# Altium schematic sheet CareLite 1.21.schdoc
size 296 x 208 mm
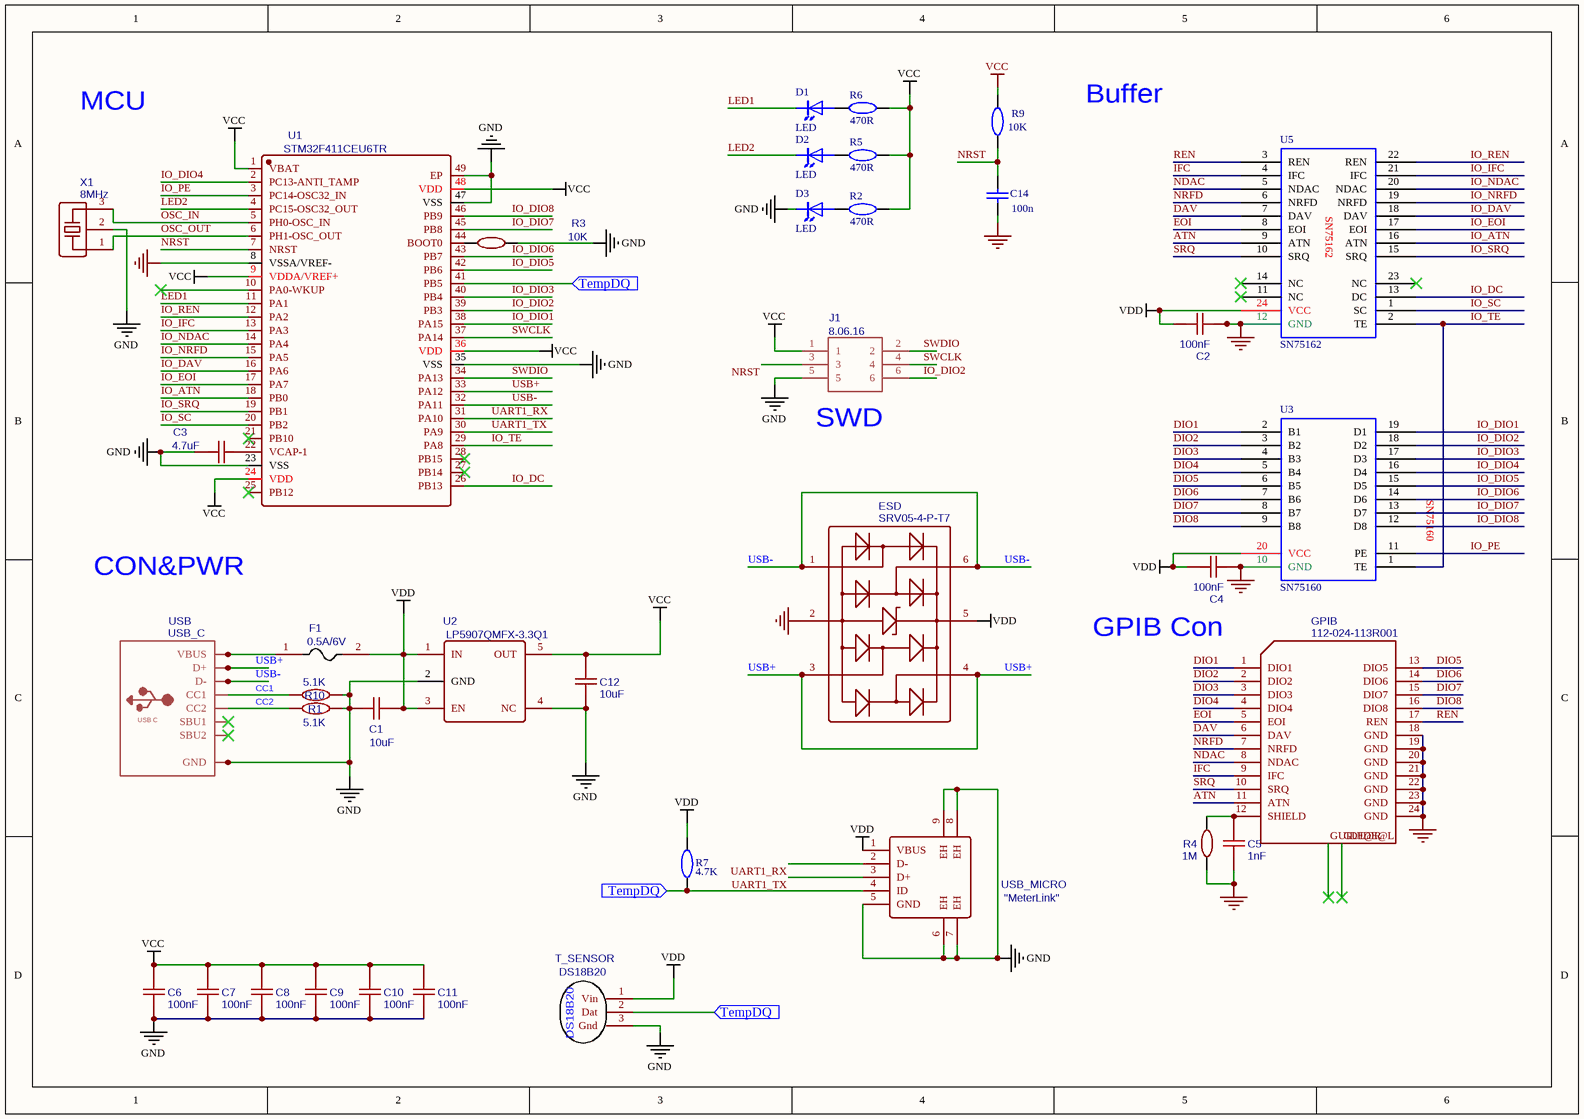
[diagram p0: CareLite 1.21.schdoc]

## Parts
C1  10uF  [C0603]
C2  100nF  [C0603]
C3  4.7uF  [C0603]
C4  100nF  [C0603]
C5  1nF  [C0603]
C6  100nF  [C0603]
C7  100nF  [C0603]
C8  100nF  [C0603]
C9  100nF  [C0603]
C10  100nF  [C0603]
C11  100nF  [C0603]
C12  10uF  [C0603]
C14  100n  [C0603]
D1  LED  [LED0603-FD]
D2  LED  [LED0603-FD]
D3  LED  [LED0603-FD]
ESD  SRV05-4-P-T7  [SOT-23-6_L2.9-W1.6-P0.95-LS2.8-BL]
F1  0.5A/6V  [0805_L_JX]
GPIB  112-024-113R001  [IEEE-488 SOCKET, 24PIN, RIGHT ANGLE, MALE, 112-024-113R001, FUY57109]
J1  8.06.16  [80616-S]
R1  5.1K  [R0603]
R2  470R  [R0603]
R3  10K  [R0603]
R4  1M  [R0603]
R5  470R  [R0603]
R6  470R  [R0603]
R7  4.7K  [R0603]
R9  10K  [R0603]
R10  5.1K  [R0603]
T_SENSOR  DS18B20  [DS18B20]
U1  STM32F411CEU6TR  [QFN-48_L7.0-W7.0-P0.50-BL-EP5.1]
U2  LP5907QMFX-3.3Q1  [SOT-23-5_L3.0-W1.7-P0.95-LS2.8-BR]
U3  SN75160  [SOIC127P1030-20AM]
U5  SN75162  [SOIC127P1030-24AM]
USB  USB_C  [USB_C_CUSB31-CFM2AX-01-Y]
USB_MICRO  "MeterLink"  [MIRCO-USB-SMD_U-D-M7DS-G-2]
X1  8MHz  [OSC-SMD_3P-L3.2-W1.3-P1.2-L]

## Ports
TempDQ (in)

## Nets
GND: C1.1 C2.2 C3.1 C4.2 C5.1 C6.1 C7.1 C8.1 C9.1 C10.1 C11.1 C12.1 C14.1 D3.2 ESD.2 GPIB.18(GND) GPIB.19(GND) GPIB.20(GND) GPIB.21(GND) GPIB.22(GND) GPIB.23(GND) GPIB.24(GND) J1.5 R1.2 R3.2 R4.2 R10.2 T_SENSOR.3(Gnd) U1.8(VSSA/VREF-) U1.23(VSS) U1.35(VSS) U1.47(VSS) U1.49(EP) U2.2(GND) U2.4(NC) U3.10(GND) U5.12(GND) USB.A1B12(GND) USB.B1A12(GND) USB_MICRO.5(GND) USB_MICRO.6(EH) USB_MICRO.7(EH) USB_MICRO.8(EH) USB_MICRO.9(EH) X1.2
VCC: C6.2 C7.2 C8.2 C9.2 C10.2 C11.2 C12.2 J1.1 R2.1 R5.1 R6.1 R9.2 U1.1(VBAT) U1.9(VDDA/VREF+) U1.24(VDD) U1.36(VDD) U1.48(VDD) U2.5(OUT)
VDD: C1.2 C2.1 C4.1 ESD.5 F1.2 R7.1 T_SENSOR.1(Vin) U2.1(IN) U2.3(EN) U3.20(VCC) U5.24(VCC) USB_MICRO.1(VBUS)
ATN: GPIB.11(ATN) U5.9(ATN)
CC1: R10.1 USB.A5(CC1)
CC2: R1.1 USB.B5(CC2)
DAV: GPIB.6(DAV) U5.7(DAV)
DIO1: GPIB.1(DIO1) U3.2(B1)
DIO2: GPIB.2(DIO2) U3.3(B2)
DIO3: GPIB.3(DIO3) U3.4(B3)
DIO4: GPIB.4(DIO4) U3.5(B4)
DIO5: GPIB.13(DIO5) U3.6(B5)
DIO6: GPIB.14(DIO6) U3.7(B6)
DIO7: GPIB.15(DIO7) U3.8(B7)
DIO8: GPIB.16(DIO8) U3.9(B8)
EOI: GPIB.5(EOI) U5.8(EOI)
IFC: GPIB.9(IFC) U5.4(IFC)
IO_ATN: U1.18(PB0) U5.16(ATN)
IO_DAV: U1.16(PA6) U5.18(DAV)
IO_DC: U1.26(PB13) U5.13(DC)
IO_DIO1: U1.38(PA15) U3.19(D1)
IO_DIO2: J1.6 U1.39(PB3) U3.18(D2)
IO_DIO3: U1.40(PB4) U3.17(D3)
IO_DIO4: U1.2(PC13-ANTI_TAMP) U3.16(D4)
IO_DIO5: U1.42(PB6) U3.15(D5)
IO_DIO6: U1.43(PB7) U3.14(D6)
IO_DIO7: U1.45(PB8) U3.13(D7)
IO_DIO8: U1.46(PB9) U3.12(D8)
IO_EOI: U1.17(PA7) U5.17(EOI)
IO_IFC: U1.13(PA3) U5.21(IFC)
IO_NDAC: U1.14(PA4) U5.20(NDAC)
IO_NRFD: U1.15(PA5) U5.19(NRFD)
IO_PE: U1.3(PC14-OSC32_IN) U3.11(PE)
IO_REN: U1.12(PA2) U5.22(REN)
IO_SC: U1.20(PB2) U5.1(SC)
IO_SRQ: U1.19(PB1) U5.15(SRQ)
IO_TE: U1.29(PA8) U3.1(TE) U5.2(TE)
LED1: D1.2 U1.11(PA1)
LED2: D2.2 U1.4(PC15-OSC32_OUT)
NDAC: GPIB.8(NDAC) U5.5(NDAC)
NRFD: GPIB.7(NRFD) U5.6(NRFD)
NRST: C14.2 J1.3 R9.1 U1.7(NRST)
OSC_IN: U1.5(PH0-OSC_IN) X1.3
OSC_OUT: U1.6(PH1-OSC_OUT) X1.1
REN: GPIB.17(REN) U5.3(REN)
SRQ: GPIB.10(SRQ) U5.10(SRQ)
SWCLK: J1.4 U1.37(PA14)
SWDIO: J1.2 U1.34(PA13)
TempDQ: R7.2 T_SENSOR.2(Dat) U1.41(PB5) USB_MICRO.4(ID) ; port TempDQ
UART1_RX: U1.31(PA10) USB_MICRO.2(D-)
UART1_TX: U1.30(PA9) USB_MICRO.3(D+)
USB+: ESD.3 ESD.4 U1.33(PA12) USB.A6(D+) USB.B6(D+)
USB-: ESD.1 ESD.6 U1.32(PA11) USB.A7(D-) USB.B7(D-)
NetC3_2: C3.2 U1.22(VCAP-1)
NetC5_2: C5.2 GPIB.12(SHIELD) R4.1
NetD1_1: D1.1 R6.2
NetD2_1: D2.1 R5.2
NetD3_1: D3.1 R2.2
NetF1_1: F1.1 USB.A4B9(VBUS) USB.B4A9(VBUS)
NetR3_1: R3.1 U1.44(BOOT0)

Not connected (* = marked no-connect by the designer): GPIB GUIDE@L(P$25)* GUIDE@R(P$26)*; U1 10(PA0-WKUP)* 21(PB10)* 25(PB12)* 27(PB14)* 28(PB15)*; U5 11(NC)* 14(NC)* 23(NC)*; USB A8(SBU1)* B8(SBU2)*

## Notes on the sheet
- MCU
- Buffer
- (near J1) SWD
- CON&PWR
- GPIB Con
- (in symbol USB_C) USB C

## Library data of the parts
C1 C12 = 10uF: Manufacturer: TAIYO YUDEN; Manufacturer Part: LMK107BJ106MALTD; nameAlias: Capacitance; Supplier: LCSC; Supplier Part: C18800; spicePre: C; spiceSymbolName: LMK107BJ106MALTD
C2 C4 C6-C11 = 100nF: Manufacturer: YAGEO; Manufacturer Part: CC0402KRX7R7BB104; nameAlias: Capacitance; Supplier: LCSC; Supplier Part: C60474; spicePre: C; spiceSymbolName: CC0402KRX7R7BB104
C3 = 4.7uF: Manufacturer: Huaxin S&T; Manufacturer Part: 0603X475K160CT; nameAlias: Capacitance; Contributor: LCSC; Supplier: LCSC; Supplier Part: C296042; spicePre: C; spiceSymbolName: 0603X475K160CT
C5 = 1nF: Manufacturer: YAGEO; Manufacturer Part: CC0603KRX7RABB102; nameAlias: Capacitance; Contributor: LCSC; Supplier: LCSC; Supplier Part: C282243; spicePre: C; spiceSymbolName: CC0603KRX7RABB102
ESD = SRV05-4-P-T7: Manufacturer: PROTEK; SMT Type: Basic; Supplier: LCSC; Manufacturer Part: SRV05-4-P-T7; LCSC Assembly: Yes; image: //image.lceda.cn/szlcsc/C85364.jpg; Supplier Part: C85364; spicePre: T; spiceSymbolName: SRV05-4-P-T7
GPIB = 112-024-113R001: Manufacturer: norcomp; Contributor: misslee; Manufacturer Part: 112-024-113R001; Supplier: Mouser; Supplier Part: 636-112-024-113R001; link: https://www.norcomp.net/series/112-series; spicePre: C; spiceSymbolName: 112-024-113R001
J1 = 8.06.16: Contributor: misslee; spicePre: J; spiceSymbolName: 8.06.16
R1 R10 = 5.1K: Manufacturer: Guangdong Fenghua Advanced Tech; Manufacturer Part: RS-03K5101FT; nameAlias: Resistance (Ohms); Contributor: LCSC; Supplier: LCSC; Supplier Part: C156350; spicePre: R; spiceSymbolName: RS-03K5101FT
R3 = 10K: Manufacturer: YAGEO; Manufacturer Part: RC0402FR-0710KL; nameAlias: Resistance (Ohms); Supplier: LCSC; Supplier Part: C60490; spicePre: R; spiceSymbolName: RC0402FR-0710KL
R4 = 1M: Manufacturer: YAGEO; Manufacturer Part: RC0603JR-071ML; nameAlias: Resistance (Ohms); Supplier: LCSC; Supplier Part: C107698; spicePre: R; spiceSymbolName: RC0603JR-071ML
T_SENSOR = DS18B20: Contributor: aleja_claros; spicePre: U; spiceSymbolName: DS18B20
U1 = STM32F411CEU6TR: Manufacturer: STMicroelectronics; Manufacturer Part: STM32F411CCU6TR; Contributor: LCSC; SMT Type: Extend; Supplier: LCSC; Supplier Part: C190642; LCSC Assembly: Yes; spicePre: U; spiceSymbolName: STM32F411CCU6TR
U2 = LP5907QMFX-3.3Q1: Manufacturer: TI; Contributor: LCSC; SMT Type: Extend; Supplier: LCSC; Manufacturer Part: LP5907QMFX-3.3Q1; Supplier Part: C130005; JLCPCB SMD: Yes; spicePre: U; spiceSymbolName: LP5907QMFX-3.3Q1
USB = USB_C: Contributor: misslee; spicePre: X; spiceSymbolName: USB_C
USB_MICRO = "MeterLink": Manufacturer: XKB Connectivity(中国星坤); Manufacturer Part: U-D-M7DS-G-2; Contributor: LCSC; Supplier: LCSC; Supplier Part: C319154; JLCPCB Part Class: Extended Part; spicePre: U; spiceSymbolName: U-D-M7DS-G-2
X1 = 8MHz: Manufacturer Part: CSTCE8M00G52-R0; Manufacturer: MuRata; nameAlias: Frequency; Supplier: LCSC; Supplier Part: C22549; spicePre: X; spiceSymbolName: CSTCE8M00G52-R0
C14 = 100n: Published: 8-Jun-2000; Revision: July-2002: Re-released for DXP Platform.; Publisher: Altium Limited
F1 = 0.5A/6V: Supplier: LCSC; spicePre: F
R2 R5 R6 = 470R: Published: 8-Jun-2000; Revision: July-2002: Re-released for DXP Platform.; Publisher: Altium Limited
R7 = 4.7K: Published: 8-Jun-2000; Revision: July-2002: Re-released for DXP Platform.; Publisher: Altium Limited
R9 = 10K: Published: 8-Jun-2000; Revision: July-2002: Re-released for DXP Platform.; Publisher: Altium Limited